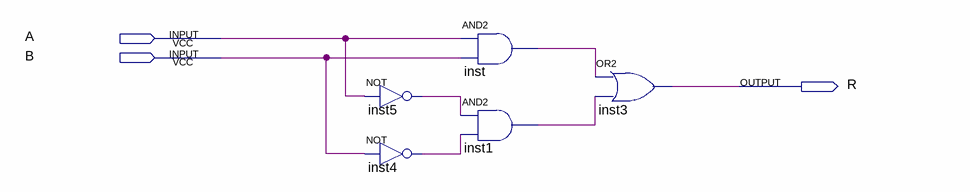
[diagram p0: schematic sheet]
// Quartus schematic swap.bdf as structural Verilog: 5 symbols, 3 pins
module swap (
  input  A,
  input  B,
  output R
);

  wire inst1_out, inst4_out, inst5_out, inst_out;

  not inst5 (inst5_out, A);
  not inst4 (inst4_out, B);
  and inst (inst_out, A, B);
  and inst1 (inst1_out, inst5_out, inst4_out);
  or inst3 (R, inst_out, inst1_out);
endmodule
